# EAGLE design W601X (EAGLE 6.6.0)
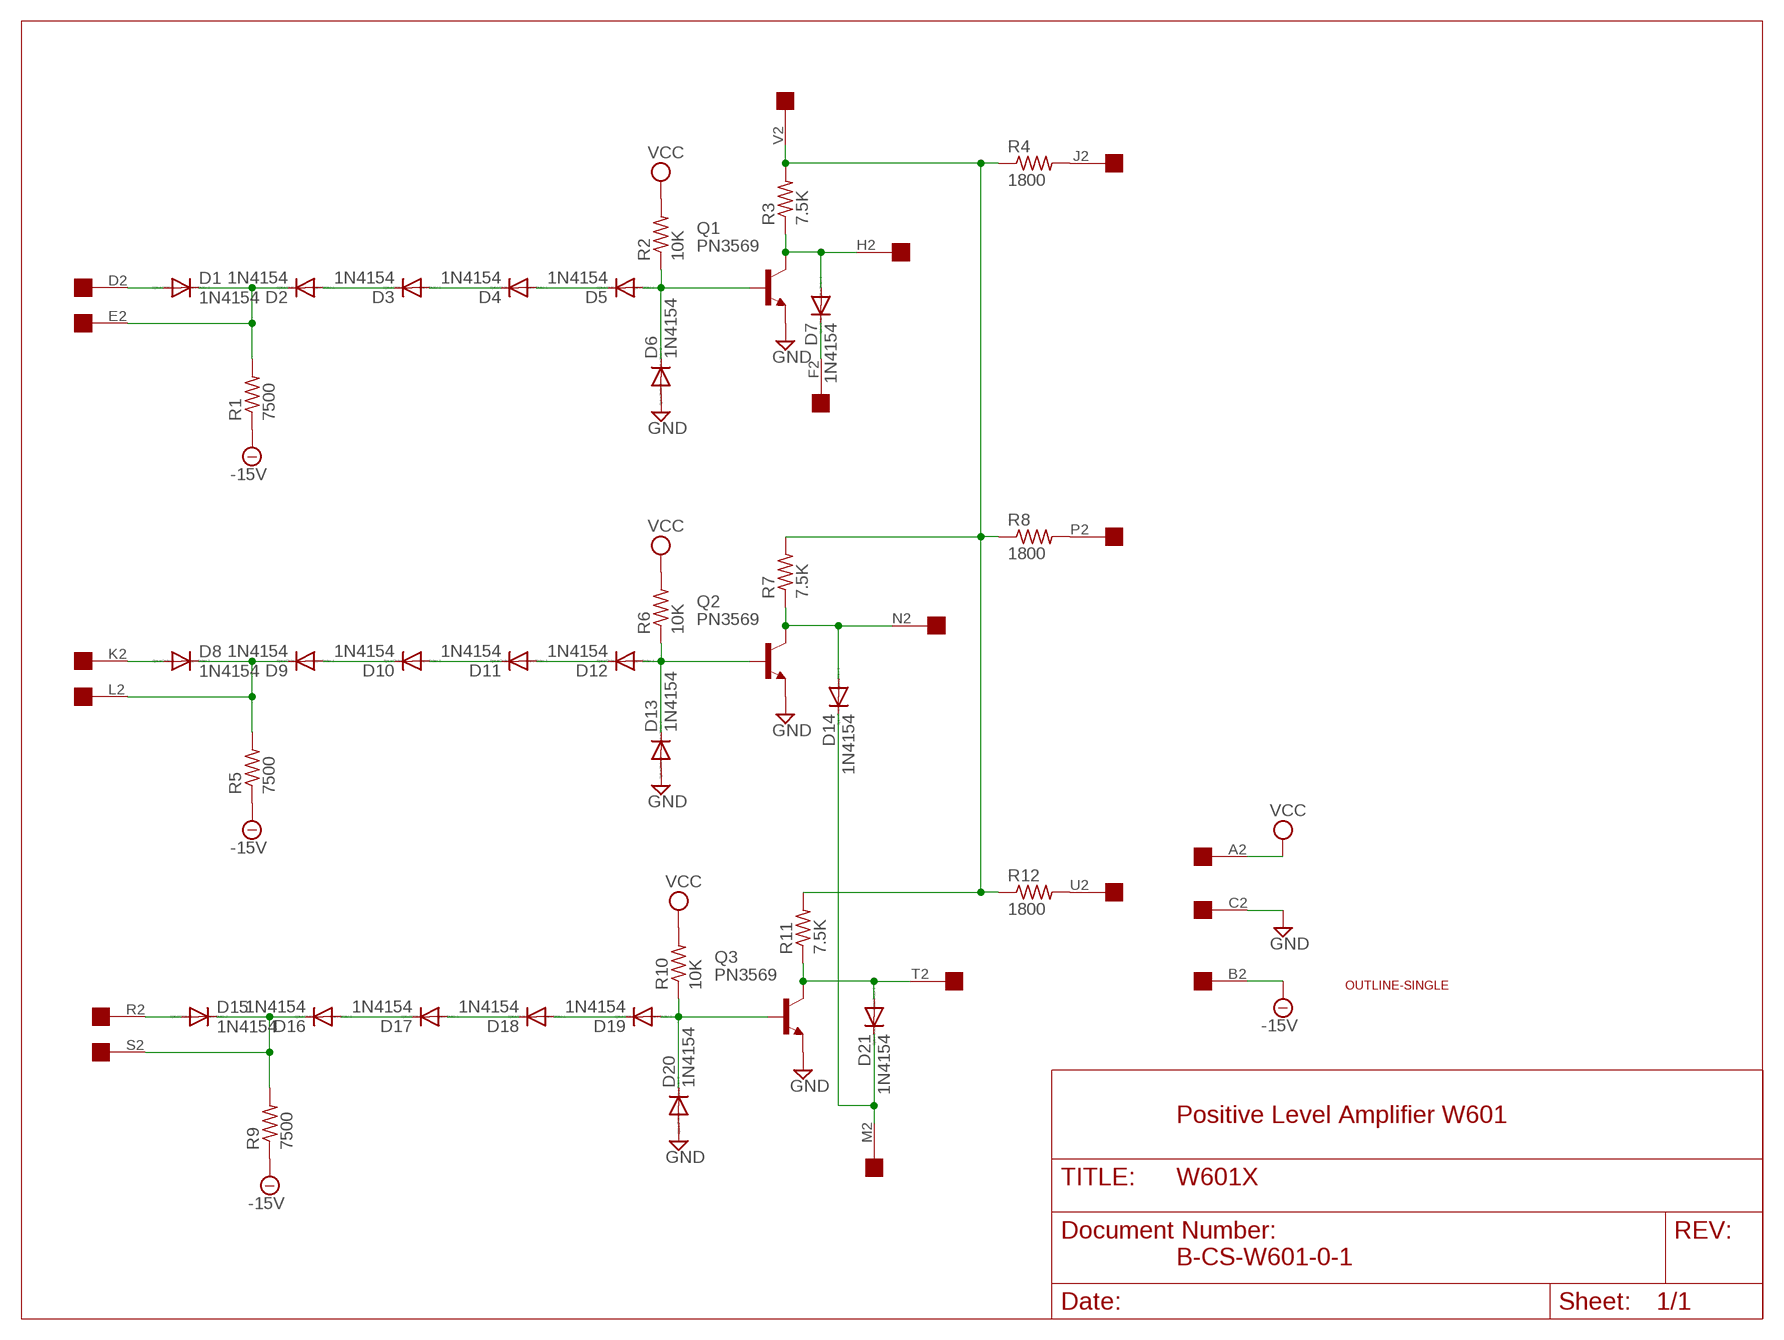
[diagram p0: schematic, sheet 1]

## Parts
D1  1N4154  DIODE-DO35-10  [DO35-10]
D2  1N4154  DIODE-DO35-10  [DO35-10]
D3  1N4154  DIODE-DO35-10  [DO35-10]
D4  1N4154  DIODE-DO35-10  [DO35-10]
D5  1N4154  DIODE-DO35-10  [DO35-10]
D6  1N4154  DIODE-DO35-10  [DO35-10]
D7  1N4154  DIODE-DO35-10  [DO35-10]
D8  1N4154  DIODE-DO35-10  [DO35-10]
D9  1N4154  DIODE-DO35-10  [DO35-10]
D10  1N4154  DIODE-DO35-10  [DO35-10]
D11  1N4154  DIODE-DO35-10  [DO35-10]
D12  1N4154  DIODE-DO35-10  [DO35-10]
D13  1N4154  DIODE-DO35-10  [DO35-10]
D14  1N4154  DIODE-DO35-10  [DO35-10]
D15  1N4154  DIODE-DO35-10  [DO35-10]
D16  1N4154  DIODE-DO35-10  [DO35-10]
D17  1N4154  DIODE-DO35-10  [DO35-10]
D18  1N4154  DIODE-DO35-10  [DO35-10]
D19  1N4154  DIODE-DO35-10  [DO35-10]
D20  1N4154  DIODE-DO35-10  [DO35-10]
D21  1N4154  DIODE-DO35-10  [DO35-10]
Q1  PN3569  -NPN-TO5  [TO5]
Q2  PN3569  -NPN-TO5  [TO5]
Q3  PN3569  -NPN-TO5  [TO5]
R1  7500  R-US_0207/10  [0207/10]
R2  10K  R-US_0207/10  [0207/10]
R3  7.5K  R-US_0207/10  [0207/10]
R4  1800  R-US_0207/10  [0207/10]
R5  7500  R-US_0207/10  [0207/10]
R6  10K  R-US_0207/10  [0207/10]
R7  7.5K  R-US_0207/10  [0207/10]
R8  1800  R-US_0207/10  [0207/10]
R9  7500  R-US_0207/10  [0207/10]
R10  10K  R-US_0207/10  [0207/10]
R11  7.5K  R-US_0207/10  [0207/10]
R12  1800  R-US_0207/10  [0207/10]
U$1  OUTLINE-SINGLE  [SINGLE]
U$2  EDGE-1  [EDGE-CON1]

## Nets
-15V: R1.1 R5.1 R9.1 U$2.B2
GND: D6.A D13.A D20.A Q1.1(E) Q2.1(E) Q3.1(E) U$2.C2
N$1: D5.A D6.C Q1.2(B) R2.1
N$2: D4.A D5.C
N$3: D1.C D2.C R1.2 U$2.E2
N$4: D1.A U$2.D2
N$5: D7.A Q1.3(C) R3.1 U$2.H2
N$6: R4.2 U$2.J2
N$7: D12.A D13.C Q2.2(B) R6.1
N$8: D11.A D12.C
N$9: D8.C D9.C R5.2 U$2.L2
N$10: D8.A U$2.K2
N$11: D14.C D21.C U$2.M2
N$12: R8.2 U$2.P2
N$13: D19.A D20.C Q3.2(B) R10.1
N$14: D18.A D19.C
N$15: D15.C D16.C R9.2 U$2.S2
N$16: D15.A U$2.R2
N$17: D7.C U$2.F2
N$18: R12.2 U$2.U2
N$19: R3.2 R4.1 R7.2 R8.1 R11.2 R12.1 U$2.V2
N$20: D16.A D17.C
N$21: D17.A D18.C
N$22: D9.A D10.C
N$23: D10.A D11.C
N$24: D2.A D3.C
N$25: D14.A Q2.3(C) R7.1 U$2.N2
N$26: D21.A Q3.3(C) R11.1 U$2.T2
N$27: D3.A D4.C
VCC: R2.2 R6.2 R10.2 U$2.A2

## Notes on the sheet
- Positive Level Amplifier W601
- B-CS-W601-0-1

## Library data of the parts
D1-D21 = diode:DIODE-: DIODE
Q1-Q3 = transistor:*-NPN-: NPN Transistror BF959 corrected 2008.03.06
R1-R12 = rcl:R-US_: RESISTOR, American symbol
U$1 = dec-con:OUTLINE-*: Board outlines for DEC boards.
U$2 = dec-con:EDGE-1: Single-Sided DEC Edge Connector -- (side 2)

## Net classes
0 default: width 0.813 mm

## Board
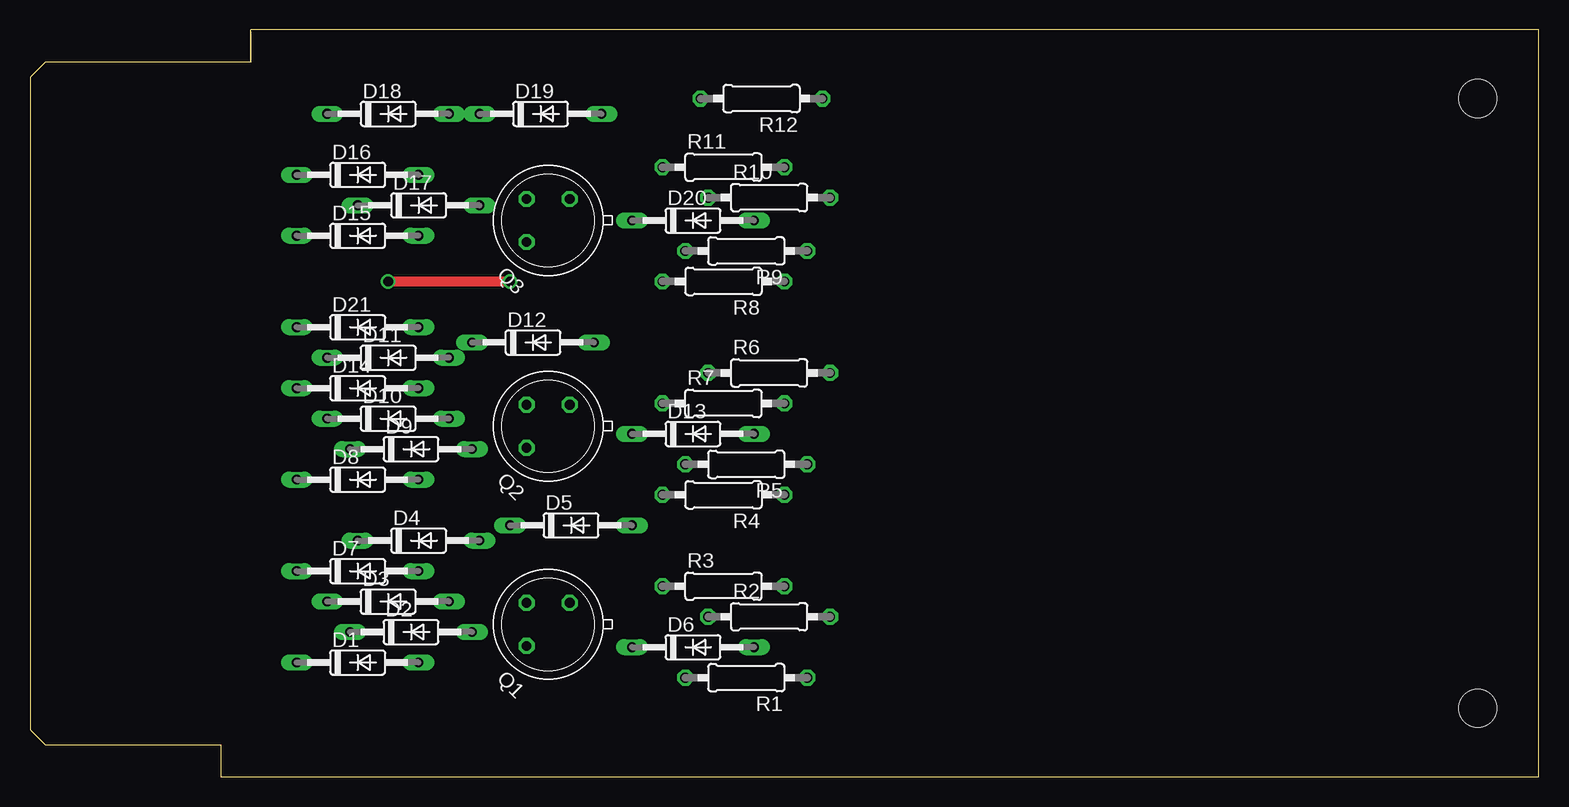
[diagram p1: board, top side]
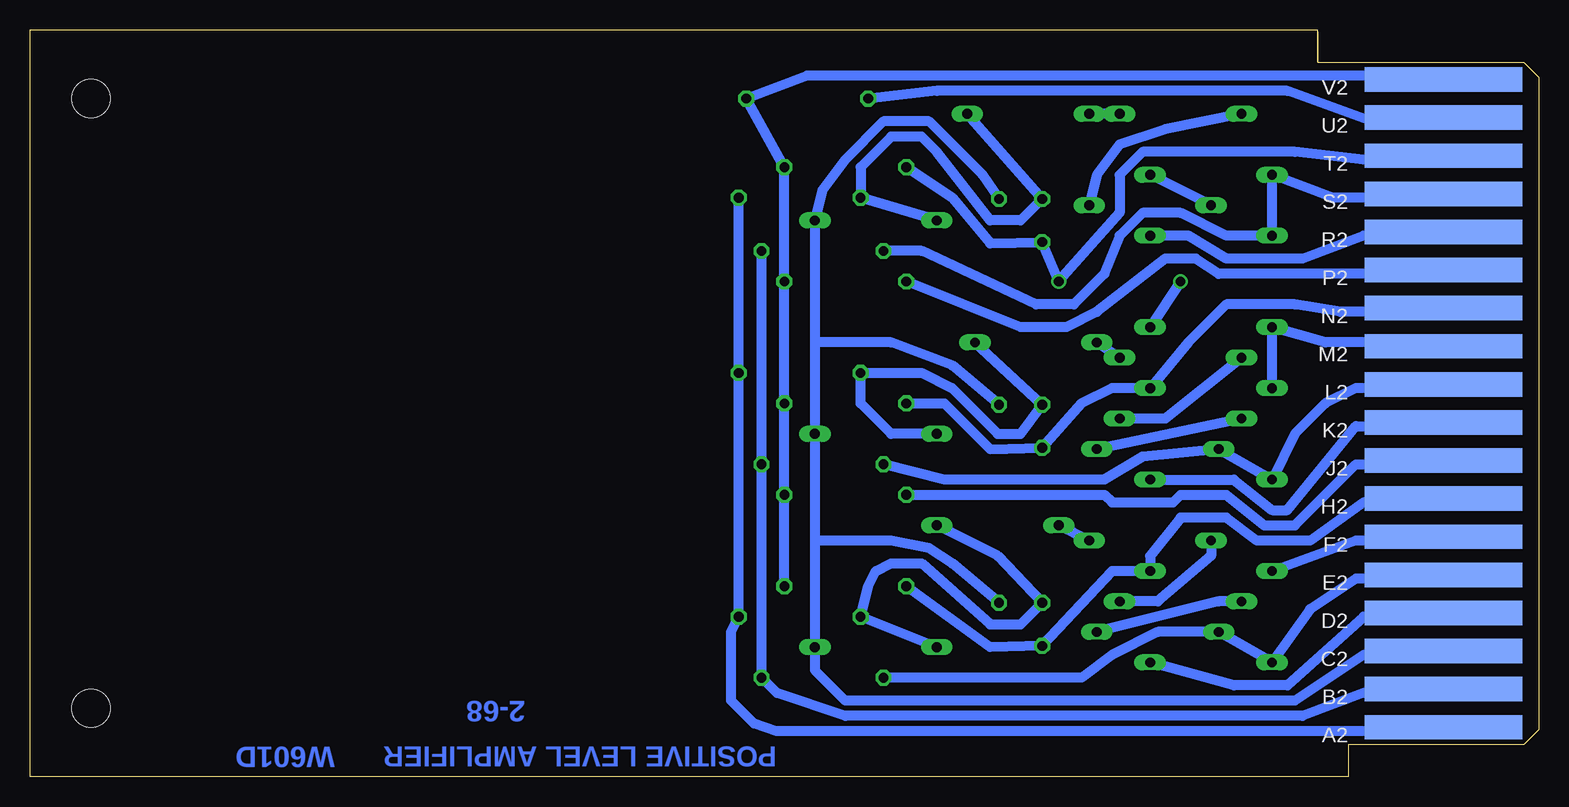
[diagram p2: board, bottom side, seen from below]

Size 125.73 x 62.23 mm. Coordinates in mm from the lower left corner, seen from the top.
Copper layers (1+16): Top 0.035mm / dielectric 1.5mm / Bottom 0.035mm
Design rules "16mils": minimum track width 16mil, minimum drill 32mil, track to track 15mil, track to pad 10mil, pad to pad 10mil, via to via 10mil, smd to smd 10mil, copper to edge 13mil, drill to drill 10mil, minimum pad ring 10mil, minimum via ring 8mil, stop-mask expansion 0mil, vias tented up to drill 0mil, thermal gap 10mil

### Footprints (pad centres in the part's own frame; a part is rotated, then mirrored left to right if it is on the bottom)
DO35-10 = drill 0.813 long: A 5.08,0; C -5.08,0
TO5 = drill 0.813 octagon: 1 0,-2.54; 2 2.54,0; 3 0,2.54
0207/10 = drill 0.813 octagon: 1 -5.08,0; 2 5.08,0
SINGLE = hole 3.175: 120.65,56.515; 120.65,5.715
EDGE-CON1 = smd 13.106 x 2.032 bottom: A2 7.938,4.128; B2 7.938,7.303; C2 7.938,10.477; D2 7.938,13.652; E2 7.938,16.828; F2 7.938,20.003; H2 7.938,23.177; J2 7.938,26.352; K2 7.938,29.527; L2 7.938,32.703; M2 7.938,35.877; N2 7.938,39.053; P2 7.938,42.227; R2 7.938,45.403; S2 7.938,48.578; T2 7.938,51.752; U2 7.938,54.928; V2 7.938,58.102

### Placement (x,y rotation side)
D1  27.31,9.53 0 top
D2  31.75,12.06 0 top
D3  29.85,14.61 0 top
D4  32.39,19.68 0 top
D5  45.09,20.95 0 top
D6  55.25,10.79 0 top
D7  27.31,17.14 0 top
D8  27.31,24.77 0 top
D9  31.75,27.3 0 top
D10  29.85,29.84 0 top
D11  29.85,34.92 0 top
D12  41.91,36.2 0 top
D13  55.25,28.57 0 top
D14  27.31,32.38 0 top
D15  27.31,45.09 0 top
D16  27.31,50.16 0 top
D17  32.39,47.62 0 top
D18  29.85,55.24 0 top
D19  42.55,55.24 0 top
D20  55.25,46.35 0 top
D21  27.31,37.47 0 top
Q1  43.18,12.7 135 top
Q2  43.18,29.21 135 top
Q3  43.18,46.35 135 top
R1  59.69,8.26 180 top
R2  61.6,13.34 0 top
R3  57.79,15.88 0 top
R4  57.79,23.5 180 top
R5  59.69,26.04 180 top
R6  61.6,33.66 0 top
R7  57.79,31.11 0 top
R8  57.79,41.27 180 top
R9  59.69,43.81 180 top
R10  61.6,48.26 0 top
R11  57.79,50.8 0 top
R12  60.96,56.52 180 top
U$1  0,0 0 top
U$2  0,0 0 top

### Tracks (layer width: path | path; a pad name or v marks a point on that pad's centre or on a via)
-15V
  Bottom 0.813: U$2.B2 9.53,6.99 14.61,6.99 19.69,5.08 57.79,5.08 63.5,6.99 R1.1 R5.1 R9.1
GND
  Bottom 0.813: U$2.C2 8.89,10.16 14.61,10.16 20.32,6.35 57.79,6.35 60.33,8.89 D6.A 60.33,19.68 | Q1.1 48.9,17.78 50.8,19.05 53.98,19.68 60.33,19.68 | Q2.1 48.9,34.29 53.98,36.2 60.33,36.2 | 60.33,36.2 D13.A 60.33,19.68 | 60.33,36.2 D20.A 59.69,48.9 57.79,51.44 54.61,54.61 50.8,54.61 46.36,50.16 Q3.1
N$1
  Bottom 0.813: D5.A 45.09,18.41 Q1.2 43.18,12.7 45.72,12.7 51.44,17.78 53.98,17.78 55.25,17.14 55.88,15.88 R2.1 D6.C
N$2
  Bottom 0.813: D4.A D5.C
N$3
  Bottom 0.813: R1.2 38.1,8.26 35.56,10.16 31.75,12.06 D2.C D1.C 19.05,13.97 15.24,16.51 8.89,16.51 U$2.E2
N$4
  Bottom 0.813: U$2.D2 8.26,13.34 14.61,13.34 20.96,7.62 25.4,7.62 D1.A
N$5
  Bottom 0.813: R3.1 45.72,10.79 Q1.3 35.56,17.14 D7.A 32.39,18.41 29.85,21.59 26.04,21.59 23.5,19.68 19.05,19.68 14.61,22.86 8.89,22.86 U$2.H2
N$6
  Bottom 0.813: R4.2 36.2,23.5 35.56,22.86 30.48,22.86 29.85,23.5 26.04,23.5 22.86,20.95 20.32,20.95 15.24,26.04 8.89,26.04 U$2.J2
N$7
  Bottom 0.813: D12.A Q2.2 43.18,28.57 45.09,28.57 48.9,32.38 51.44,33.66 R6.1 56.52,31.11 53.98,28.57 D13.C
N$8
  Bottom 0.813: D12.C D11.A
N$9
  Bottom 0.813: U$2.L2 8.89,32.38 15.24,32.38 17.78,31.11 20.32,28.57 D8.C D9.C 33.02,26.67 36.2,24.77 49.53,24.77 R5.2
N$10
  Bottom 0.813: D8.A 25.4,24.77 22.23,22.23 20.96,22.23 15.24,29.21 8.26,29.21 U$2.K2
N$11
  Bottom 0.813: U$2.M2 8.89,36.2 17.78,36.2 D21.C D14.C
N$12
  Bottom 0.813: U$2.P2 8.26,41.91 26.67,41.91 28.58,43.18 31.12,43.18 36.83,38.73 39.37,37.47 43.18,37.47 R8.2
N$13
  Bottom 0.813: D20.C R10.1 56.52,50.8 53.98,53.34 51.44,53.34 50.17,52.07 45.72,46.35 43.18,46.35 Q3.2 D19.A
N$14
  Bottom 0.813: D18.A D19.C
N$15
  Bottom 0.813: U$2.S2 8.26,48.26 17.15,48.26 D16.C D15.C 26.04,45.09 29.85,46.99 33.02,46.99 34.93,45.09 36.2,41.91 38.74,39.37 41.91,39.37 51.44,43.81 R9.2
N$16
  Bottom 0.813: U$2.R2 9.53,45.09 14.61,45.09 19.69,43.18 26.04,43.18 29.21,45.09 D15.A
N$17
  Bottom 0.813: U$2.F2 8.89,19.68 15.24,19.68 D7.C
N$18
  Bottom 0.813: U$2.U2 8.89,54.61 13.97,54.61 20.96,57.15 50.17,57.15 R12.2
N$19
  Bottom 0.813: U$2.V2 8.89,58.42 60.96,58.42 R12.1 R11.2 R8.1 R7.2 R4.1 R3.2
N$20
  Bottom 0.813: D17.C D16.A
N$21
  Bottom 0.813: D18.C 31.12,53.98 34.93,52.7 36.83,50.16 D17.A
N$22
  Bottom 0.813: D10.C D9.A
N$23
  Bottom 0.813: D11.C 31.12,29.84 D10.A
N$24
  Bottom 0.813: D3.C 26.67,14.61 D2.A
N$25
  Bottom 0.813: R7.1 49.53,31.11 45.72,27.3 Q2.3 38.1,31.11 35.56,32.38 D14.A 29.21,36.2 26.04,39.37 20.32,39.37 16.51,38.73 9.53,38.73 U$2.N2
N$26  (via drill 0.81)
  Top 0.813: v29.85,41.27 v40.01,41.27
  Bottom 0.813: U$2.T2 8.26,51.44 14.61,51.44 20.32,52.07 33.02,52.07 34.93,50.16 34.93,46.99 v40.01,41.27 Q3.3 45.72,44.45 48.9,48.26 R11.1 | D21.A v29.85,41.27
N$27
  Bottom 0.813: D4.C 27.31,18.41 31.75,14.61 D3.A
VCC
  Bottom 0.813: U$2.A2 8.89,3.81 63.5,3.81 65.41,4.45 67.31,6.35 67.31,12.06 R2.2 R6.2 R10.2

### Text on the board
Bottom: 2-68 | POSITIVE LEVEL AMPLIFIER | W601D
200bmp: C:/Users/Vince/Documents/eagle/projects/DEC/Wxxx/W601/W601Dbackfb.bmp